# EAGLE schematic simulacion (EAGLE 9.6.2)
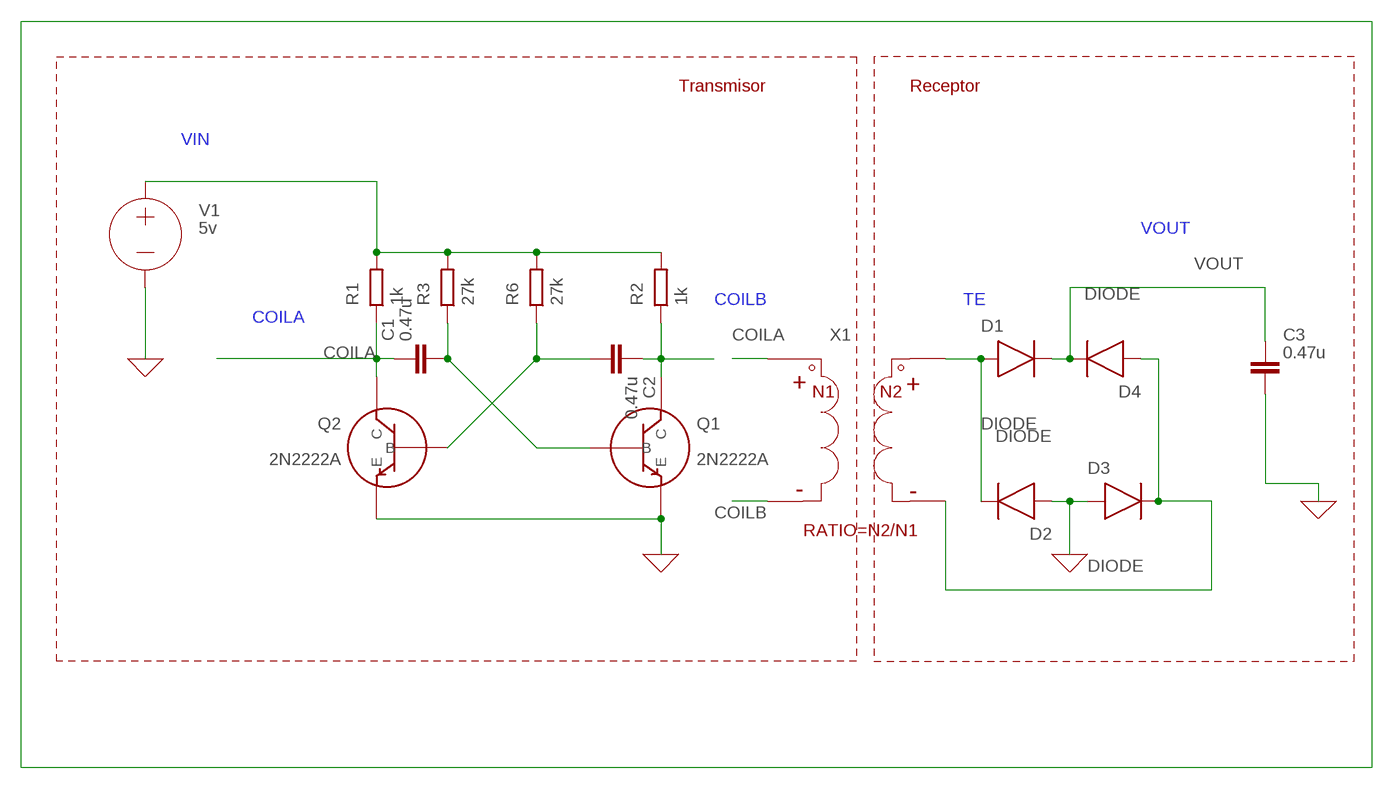
[diagram p0: schematic, sheet 1]

## Parts
C1  0.47u  C  (no package)
C2  0.47u  C  (no package)
C3  0.47u  C  (no package)
D1  DIODE  (no package)
D2  DIODE  (no package)
D3  DIODE  (no package)
D4  DIODE  (no package)
Q1  BJT_NPN  (no package)
Q2  BJT_NPN  (no package)
R1  1k  R  (no package)
R2  1k  R  (no package)
R3  27k  R  (no package)
R6  27k  R  (no package)
V1  5v  VOLTAGE  (no package)
X1  TRANSFORMER  (no package)

## Nets
0: C3.2 D2.A D3.A Q1.E Q2.E V1.- ; supply symbol labelled GND
COILA: C1.1 Q2.C R1.1 X1.P$1
COILB: C2.1 Q1.C R2.1 X1.P$2
N$2: C1.2 Q1.B R3.1
N$4: C2.2 Q2.B R6.1
N$7: D3.C D4.A X1.P$4
TE: D1.A D2.C X1.P$3
VIN: R1.2 R2.2 R3.2 R6.2 V1.+
VOUT: C3.1 D1.C D4.C

## Notes on the sheet
- Transmisor | Receptor

## Library data of the parts
C1-C3 = ngspice-simulation:C: CAPACITOR; SPICEINITCOND: 1V
D1-D4 = ngspice-simulation:DIODE: Diode
Q1 Q2 = ngspice-simulation:BJT_NPN: Bipolar NPN Transistor; SPICEMODEL: 2N2222A; SPICEPREFIX: Q
R1-R3 R6 = ngspice-simulation:R: RESISTOR
V1 = ngspice-simulation:VOLTAGE: Independent Voltage Source, either DC, AC, PULSE, SINE, PWL, EXP, or SFFM; VALUE: 0V
X1 = ngspice-simulation:TRANSFORMER: Coupled inductors The RATIO is defined in the schematic by using the text command and adding a line that says: .PARAM RATIO=x Where x is the turns ratio of the transformer